# EAGLE design Yukari 3 11DoF (EAGLE 6.2)
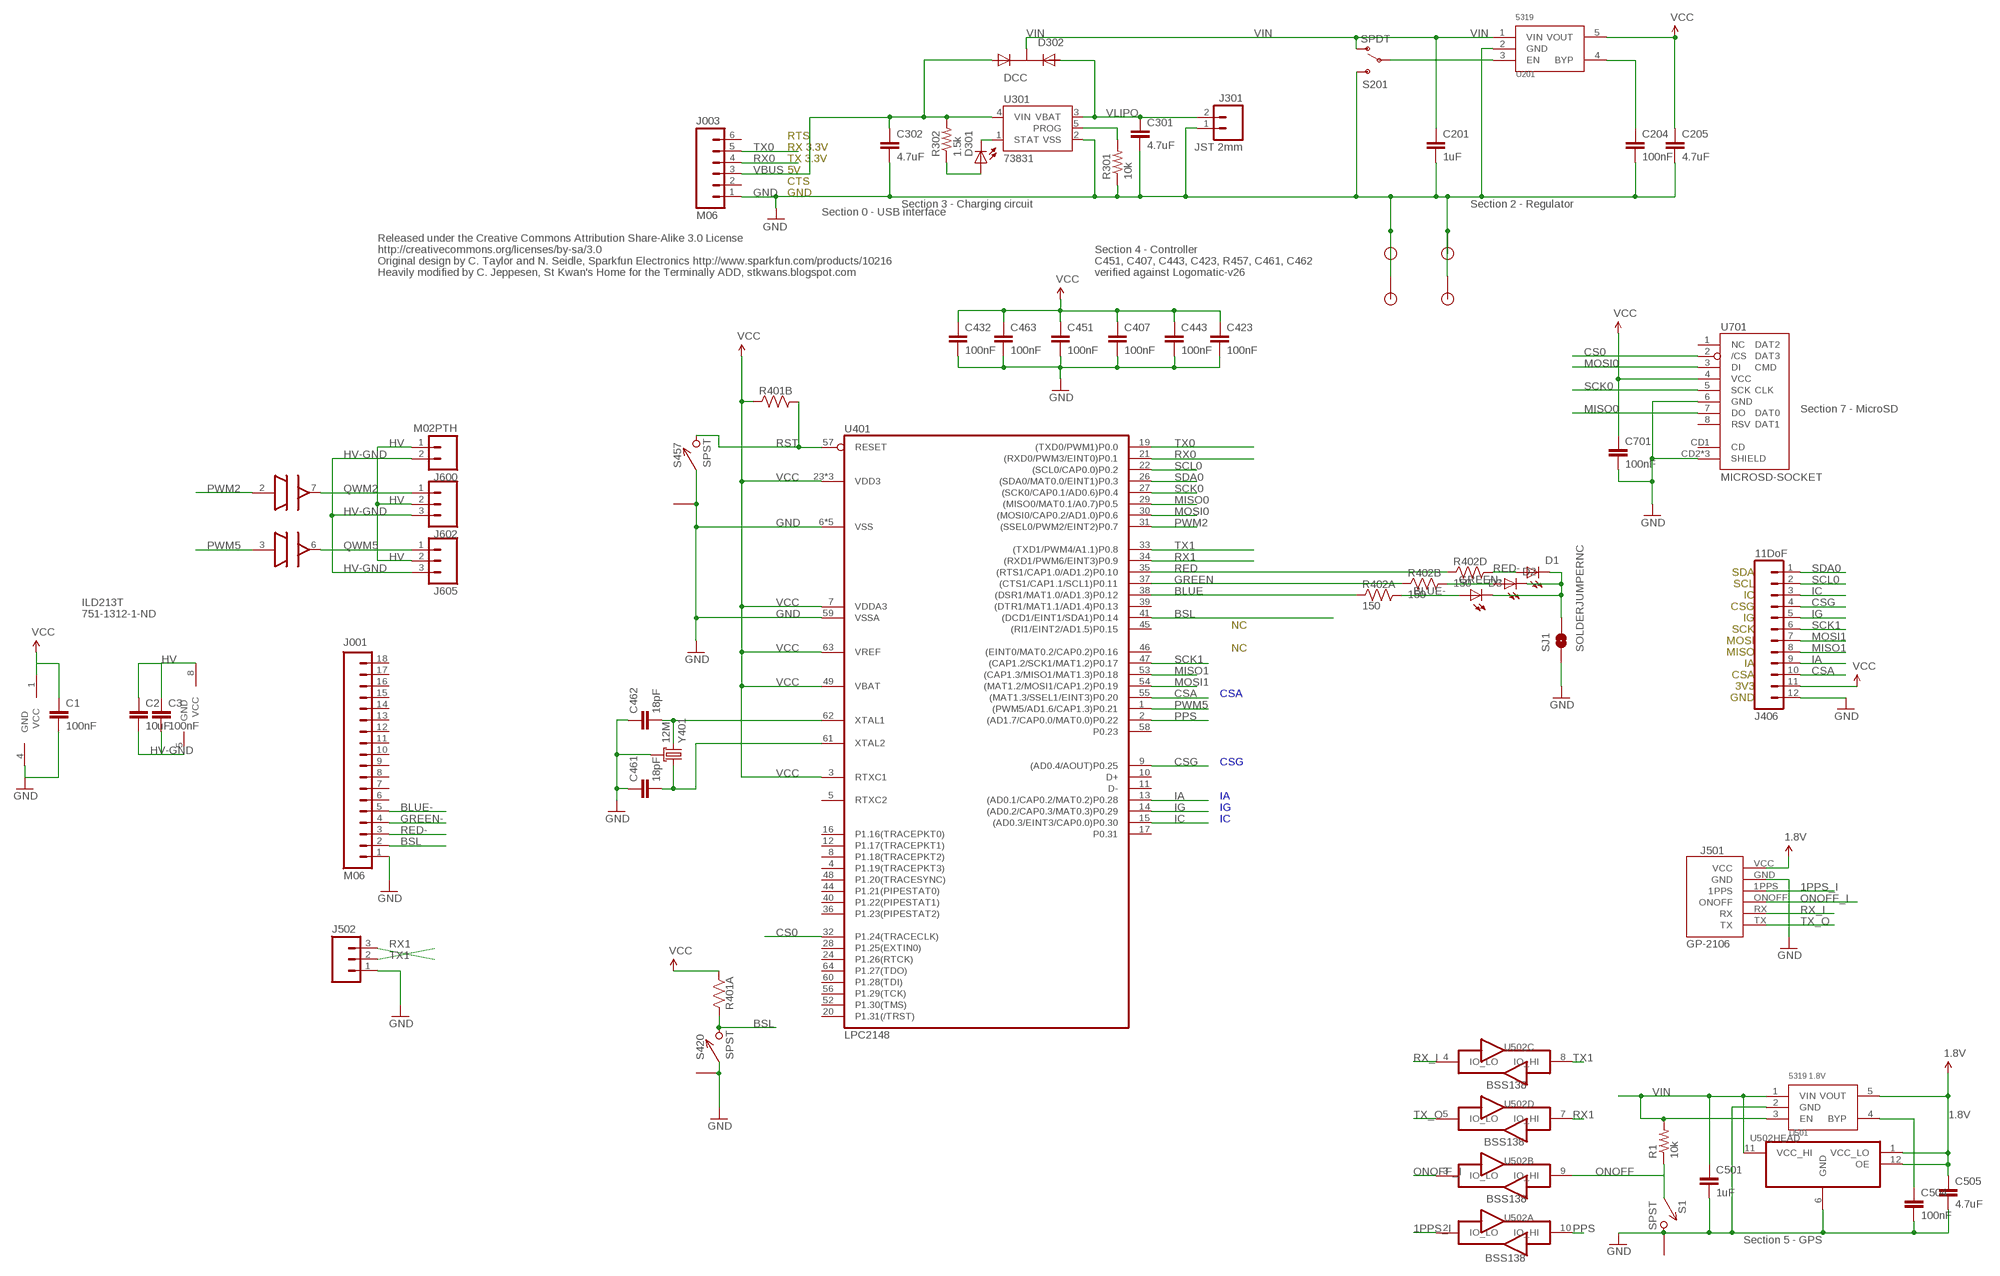
[diagram p0: schematic, sheet 1]

## Parts
C1  100nF  CAP0402-CAP  [0402-CAP]
C2  10uF  10UF-6.3V-20%(1206)  [1206]
C3  100nF  CAP0402-CAP  [0402-CAP]
C201  1uF  CAP0402-CAP  [0402-CAP]
C204  100nF  CAP0402-CAP  [0402-CAP]
C205  4.7uF  CAP0402-CAP  [0402-CAP]
C301  4.7uF  CAP0402-CAP  [0402-CAP]
C302  4.7uF  CAP0402-CAP  [0402-CAP]
C407  100nF  CAP0402-CAP  [0402-CAP]
C423  100nF  CAP0402-CAP  [0402-CAP]
C432  100nF  CAP0402-CAP  [0402-CAP]
C443  100nF  CAP0402-CAP  [0402-CAP]
C451  100nF  CAP0402-CAP  [0402-CAP]
C461  18pF  CAP0402-CAP  [0402-CAP]
C462  18pF  CAP0402-CAP  [0402-CAP]
C463  100nF  CAP0402-CAP  [0402-CAP]
C501  1uF  CAP0402-CAP  [0402-CAP]
C504  100nF  CAP0402-CAP  [0402-CAP]
C505  4.7uF  CAP0402-CAP  [0402-CAP]
C701  100nF  CAP0402-CAP  [0402-CAP]
D1  RED  LED0603  [LED-0603]
D2  GREEN  LED0603  [LED-0603]
D3  BLUE  LED0603  [LED-0603]
D301  RED  LED0603  [LED-0603]
D302  DCC  PMEG2005CT  [SOT-23-3]
J001  M06  M18_  [1X18]
J003  M06  M06SIP  [1X06]
J301  JST 2mm  M02-JST-2MM-SMT  [JST-2-SMD]
J406  11DoF  M12PTH  [1X12]
J501  GP-2106  [GP-2106]
J502  M03PTH  [1X03]
J600  M02PTH  [1X02]
J602  M03PTH  [1X03]
J605  M03PTH  [1X03]
JP1  STANDOFF  [STANDOFF]
JP2  STANDOFF  [STANDOFF]
JP3  STANDOFF  [STANDOFF]
JP4  STANDOFF  [STANDOFF]
R1  10k  RESISTOR0402-RES  [0402-RES]
R301  10k  RESISTOR0402-RES  [0402-RES]
R302  1.5k  RESISTOR0402-RES  [0402-RES]
R401  RP2EXB24V  [CRA02]
R402  150  RP404  [CRA04]
S1  SPST  B3U-1100P  [B3U-1100P]
S201  SPDT  SWITCH-SPSTSMD  [AYZ0202]
S420  SPST  B3U-1100P  [B3U-1100P]
S457  SPST  B3U-1100P  [B3U-1100P]
SJ1  SOLDERJUMPERNC  [SJ_2S]
U201  5319  MIC5319D5  [SOT-23-5]
U301  73831  MCP73831  [SOT23-5]
U401  LPC2148  [LQFP64]
U501  5319 1.8V  MIC5319D5  [SOT-23-5]
U502  TXB0104RUT  [R-PUQFN-N12]
U600  ADUM3221  [SO8N]
U701  MICROSD-SOCKET  [MICROSD-SOCKET-PP]
Y401  12M  TSX-3225  [CRYSTAL_SMD]

## Nets
1.8V: C505.1 J501.VCC U501.5(VOUT) U502.1(HEAD:VCC_LO) U502.12(HEAD:OE)
1PPS_I: J501.1PPS U502.2(A:IO_LO)
BLUE: R402.1 U401.38((DSR1/MAT1.0/AD1.3)P0.12)
BLUE-: D3.A J001.5 R402.8
BSL: J001.2 R401.4 S420.P$2 U401.41((DCD1/EINT1/SDA1)P0.14)
CHG_PROG: R301.2 U301.5(PROG)
CS0: U401.32(P1.24(TRACECLK)) U701.2(/CS)
CSA: J406.10 U401.55((MAT1.3/SSEL1/EINT3)P0.20)
CSG: J406.4 U401.9((AD0.4/AOUT)P0.25)
EN: S201.2(P) U201.3(EN)
GND: C1.2 C201.2 C204.2 C205.2 C301.2 C302.2 C407.2 C423.2 C432.2 C443.2 C451.2 C461.1 C462.1 C463.2 C501.2 C504.2 C505.2 C701.2 J001.1 J003.1 J301.1 J406.12 J501.GND J502.1 JP1.P$1 JP2.P$1 JP3.P$1 JP4.P$1 R301.1 S1.P$2 S1.P$3 S201.3(S) S420.P$1 S420.P$3 S457.P$1 S457.P$3 SJ1.1 U201.2(GND) U301.2(VSS) U401.6(VSS) U401.18(VSS) U401.25(VSS) U401.42(VSS) U401.50(VSS) U401.59(VSSA) U501.2(GND) U502.6(HEAD:GND) U600.4(INP:GND) U701.6(GND) U701.CD2(SHIELD) U701.GND1(SHIELD) U701.GND3(SHIELD) Y401.2(GND) Y401.4(GND)
GREEN: R402.2 U401.37((CTS1/CAP1.1/SCL1)P0.11)
GREEN-: D2.A J001.4 R402.7
HV: C2.1 C3.1 J600.1 J602.2 J605.2 U600.8(OUTP:VCC)
HV-GND: C2.2 C3.2 J600.2 J602.3 J605.3 U600.5(OUTP:GND)
IA: J406.9 U401.13((AD0.1/CAP0.2/MAT0.2)P0.28)
IC: J406.3 U401.15((AD0.3/EINT3/CAP0.0)P0.30)
IG: J406.5 U401.14((AD0.2/CAP0.3/MAT0.3)P0.29)
MISO0: U401.29((MISO0/MAT0.1/A0.7)P0.5) U701.7(DO)
MISO1: J406.8 U401.53((CAP1.3/MISO1/MAT1.3)P0.18)
MOSI0: U401.30((MOSI0/CAP0.2/AD1.0)P0.6) U701.3(DI)
MOSI1: J406.7 U401.54((MAT1.2/MOSI1/CAP1.2)P0.19)
N$1: D1.C D2.C D3.C SJ1.2
N$12: C504.1 U501.4(BYP)
N$17: C204.1 U201.4(BYP)
ONOFF: R1.1 S1.P$1 U502.9(B:IO_HI)
ONOFF_I: J501.ONOFF U502.3(B:IO_LO)
PPS: U401.2((AD1.7/CAP0.0/MAT0.0)P0.22) U502.10(A:IO_HI)
PWM2: U401.31((SSEL0/PWM2/EINT2)P0.7) U600.2(A:IN)
PWM5: U401.1((PWM5/AD1.6/CAP1.3)P0.21) U600.3(B:IN)
QWM2: J602.1 U600.7(A:OUT)
QWM5: J605.1 U600.6(B:OUT)
RED: R402.4 U401.35((RTS1/CAP1.0/AD1.2)P0.10)
RED-: D1.A J001.3 R402.5
RST: R401.3 S457.P$2 U401.57(RESET)
RX0: J003.4 U401.21((RXD0/PWM3/EINT0)P0.1)
RX1: J502.2 U401.34((RXD1/PWM6/EINT3)P0.9) U502.7(D:IO_HI)
RX_I: J501.RX U502.4(C:IO_LO)
SCK0: U401.27((SCK0/CAP0.1/AD0.6)P0.4) U701.5(SCK)
SCK1: J406.6 U401.47((CAP1.2/SCK1/MAT1.2)P0.17)
SCL0: J406.2 U401.22((SCL0/CAP0.0)P0.2)
SDA0: J406.1 U401.26((SDA0/MAT0.0/EINT1)P0.3)
STAT+: D301.A R302.1
STAT-: D301.C U301.1(STAT)
TX0: J003.5 U401.19((TXD0/PWM1)P0.0)
TX1: J502.3 U401.33((TXD1/PWM4/A1.1)P0.8) U502.8(C:IO_HI)
TX_O: J501.TX U502.5(D:IO_LO)
VBUS [power]: C302.1 D302.1(A1) J003.3 R302.2 U301.4(VIN)
VCC: C1.1 C205.1 C407.1 C423.1 C432.1 C443.1 C451.1 C463.1 C701.1 J406.11 R401.1 R401.2 U201.5(VOUT) U401.3(RTXC1) U401.7(VDDA3) U401.23(VDD3) U401.43(VDD3) U401.49(VBAT) U401.51(VDD3) U401.63(VREF) U600.1(INP:VCC) U701.4(VCC)
VIN: C201.1 C501.1 D302.3(K) R1.2 S201.1(O) U201.1(VIN) U501.1(VIN) U501.3(EN) U502.11(HEAD:VCC_HI)
VLIPO [power]: C301.1 D302.2(A2) J301.2 U301.3(VBAT)
XTAL1: C462.2 U401.62(XTAL1) Y401.3
XTAL2: C461.2 U401.61(XTAL2) Y401.1
Unconnected: J001.6 J001.7 J001.8 J001.9 J001.10 J001.11 J001.12 J001.13 J001.14 J001.15 J001.16 J001.17 J001.18 J003.2 J003.6 R402.3 R402.6 U401.4(P1.19(TRACEPKT3)) U401.5(RTXC2) U401.8(P1.18(TRACEPKT2)) U401.10(D+) U401.11(D-) U401.12(P1.17(TRACEPKT1)) U401.16(P1.16(TRACEPKT0)) U401.17(P0.31) U401.20(P1.31(/TRST)) U401.24(P1.26(RTCK)) U401.28(P1.25(EXTIN0)) U401.36(P1.23(PIPESTAT2)) U401.39((DTR1/MAT1.1/AD1.4)P0.13) U401.40(P1.22(PIPESTAT1)) U401.44(P1.21(PIPESTAT0)) U401.45((RI1/EINT2/AD1.5)P0.15) U401.46((EINT0/MAT0.2/CAP0.2)P0.16) U401.48(P1.20(TRACESYNC)) U401.52(P1.30(TMS)) U401.56(P1.29(TCK)) U401.58(P0.23) U401.60(P1.28(TDI)) U401.64(P1.27(TDO)) U701.1(NC) U701.8(RSV) U701.CD1(CD)

## Notes on the sheet
- RTS
- RX 3.3V
- TX 3.3V
- 5V
- CTS
- GND
- Section 0 - USB interface | Section 3 - Charging circuit | Section 2 - Regulator
- Released under the Creative Commons Attribution Share-Alike 3.0 License
- http://creativecommons.org/licenses/by-sa/3.0 | Section 4 - Controller
- Original design by C. Taylor and N. Seidle, Sparkfun Electronics http://www.sparkfun.com/products/10216 | C451, C407, C443, C423, R457, C461, C462
- Heavily modified by C. Jeppesen, St Kwan's Home for the Terminally ADD, stkwans.blogspot.com | verified against Logomatic-v26
- Section 7 - MicroSD
- SDA
- SCL
- IC
- ILD213T | CSG
- 751-1312-1-ND | IG
- NC | SCK
- MOSI
- NC | MISO
- IA
- CSA
- 3V3
- CSA | GND
- CSG
- IA
- IG
- IC
- BSS138
- BSS138
- BSS138
- Section 5 - GPS
- BSS138

## Library data of the parts
C1 C3 C201 C204 C205 C301 C302 C407 C423 C432 C443 C451 C461-C463 C701 = SparkFun:CAP: Capacitor Standard 0603 ceramic capacitor, and 0.1" leaded capacitor.
C2 = SparkFun-Capacitors:10UF-6.3V-20%(1206): Ceramic CAP-10057; PROD_ID: CAP-10057
C501 = SparkFun:CAP: Capacitor Standard 0603 ceramic capacitor, and 0.1" leaded capacitor.; DIGIKEY: 445-4114-1-ND
C504 = SparkFun:CAP: Capacitor Standard 0603 ceramic capacitor, and 0.1" leaded capacitor.; DIGIKEY: 445-1265-1-ND
C505 = SparkFun:CAP: Capacitor Standard 0603 ceramic capacitor, and 0.1" leaded capacitor.; DIGIKEY: 445-7395-1-ND
D1-D3 D301 = SparkFun:LED: LEDs Standard schematic elements and footprints for 5mm, 3mm, 1206, and 0603 sized LEDs. 5mm - Spark Fun Electronics SKU : COM-00529 (and others)
D302 = KwanSystems:PMEG2005CT
J001 = SparkFun-Connectors:M18: 1x18 .1" header
J003 = SparkFun:M06: Header 6 Standard 6-pin 0.1" header. Use with straight break away headers (SKU : PRT-00116), right angle break away headers (PRT-00553), swiss pins (PRT-00743), machine pins (PRT-00117), and female headers (PRT-00115). Molex polarized connector foot print use with SKU : PRT-08094 with associated crimp pins and housings. NOTES ON THE VARIANTS LOCK and LOCK_LONGPADS... This footprint was designed to help hold the alignment of a through-hole component (i.e. 6-pin header) while soldering it into place. You may notice that each hole has been shifted either up or down by 0.005 of an inch from it's more standard position (which is a perfectly straight line). This slight alteration caused the pins (the squares in the middle) to touch the edges of the holes. Because they are alternating, it causes a "brace" to hold the component in place. 0.005 has proven to be the perfect amount of "off-center" position when using our standard breakaway headers. Although looks a little odd when you look at the bare footprint, once you have a header in there, the alteration is very hard to notice. Also, if you push a header all the way into place, it is covered up entirely on the bottom side. This idea of altering the position of holes to aid alignment will be further integrated into the Sparkfun Library for other footprints. It can help hold any component with 3 or more connection pins.
J301 = SparkFun:M02: Header 2 Standard 2-pin 0.1" header. Use with straight break away headers (SKU : PRT-00116), right angle break away headers (PRT-00553), swiss pins (PRT-00743), machine pins (PRT-00117), and female headers (PRT-00115). Molex polarized connector foot print use with SKU : PRT-08233 with associated crimp pins and housings.
J406 = SparkFun:M12: Header 12 Standard 12-pin 0.1" header. Use with straight break away headers (SKU : PRT-00116), right angle break away headers (PRT-00553), swiss pins (PRT-00743), machine pins (PRT-00117), and female headers (PRT-00115).
J501 = SparkFun:GP-2106: GP-2106 GPS SiRF IV
J502 J602 J605 = SparkFun-Connectors:M03: Header 3 Standard 3-pin 0.1" header. Use with straight break away headers (SKU : PRT-00116), right angle break away headers (PRT-00553), swiss pins (PRT-00743), machine pins (PRT-00117), and female headers (PRT-00115). Molex polarized connector foot print use with SKU : PRT-08232 with associated crimp pins and housings.
J600 = SparkFun-Connectors:M02: Standard 2-pin 0.1" header. Use with - straight break away headers ( PRT-00116) - right angle break away headers (PRT-00553) - swiss pins (PRT-00743) - machine pins (PRT-00117) - female headers (PRT-00115) Molex polarized connector foot print use with: PRT-08233 with associated crimp pins and housings. 2.54_SCREWTERM for use with PRT-10571. 3.5mm Screw Terminal footprints for PRT-08084 5mm Screw Terminal footprints for use with PRT-08433
JP1-JP4 = KwanSystems:STANDOFF
R1 R301 R302 = SparkFun:RESISTOR: Resistor Basic schematic elements and footprints for 0603, 1206, and PTH resistors.
R401 = KwanSystems:RP2
R402 = KwanSystems:RP4
S1 S420 S457 = KwanSystems:B3U-1100P
S201 = SparkFun:SWITCH-SPST: SPST Switch Simple slide switch. Spark Fun Electronics SKU : COM-00102
SJ1 = SparkFun-Passives:SOLDERJUMPER: Solder Jumper Standard SMD solder jumper. Used to automate production. Two varients : Normally Open and Normally Closed are the same, but have different paste layers. NC will have a large amount of paste and should jumper during reflow.
U201 = KwanSystems:MIC5319
U301 = SparkFun:MCP73831: Microchip's MCP73831 Miniature single cell, fully integrated Li-Ion, Li-polymer charge management controller http://ww1.microchip.com/downloads/en/DeviceDoc/21984a.pdf
U401 = KwanSystems:LPC2148
U501 = KwanSystems:MIC5319; DIGIKEY: 576-1910-1-ND
U502 = KwanSystems:TXB0104
U600 = KwanSystems:ADUM3221
U701 = KwanSystems:MICROSD-SOCKET: microSD Socket Push-push type uSD socket. Digikey 101-00660-68-6-1-ND. tDoc lines correctly indicate media card edge positions when inserting (unlocked, locked, depressed).
Y401 = KwanSystems:TSX-3225

## Net classes
0 default: width 0.152 mm, drill 0.33 mm, clearance 0.152 mm
1 power: width 0.152 mm, drill 0.33 mm, clearance 0.152 mm
2 hp: width 0.508 mm, drill 0.33 mm, clearance 0.508 mm

## Board
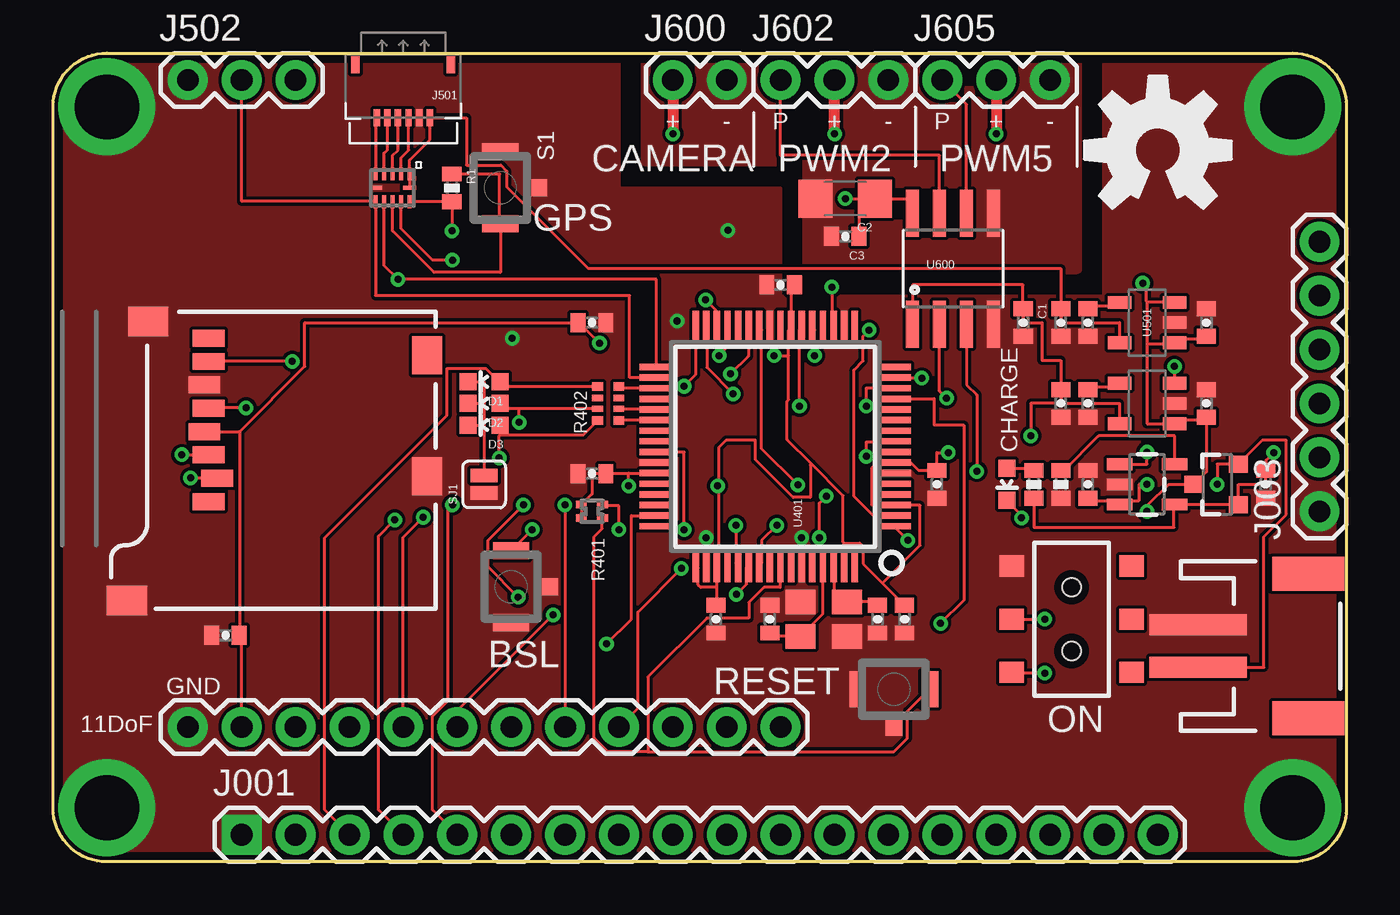
[diagram p1: board, top side]
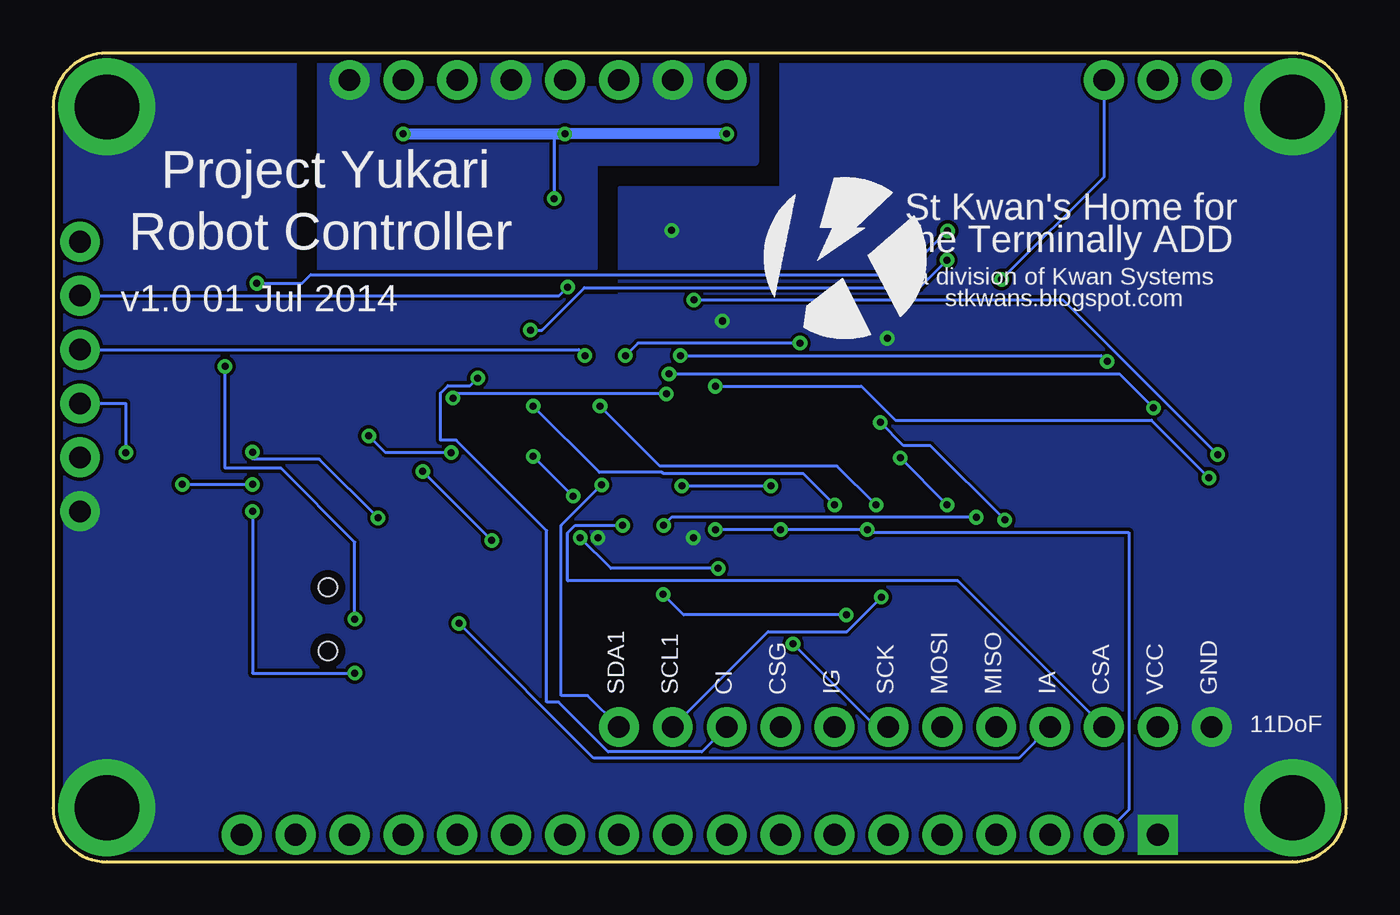
[diagram p2: board, bottom side, seen from below]

Size 60.96 x 38.1 mm. Coordinates in mm from the lower left corner, seen from the top.
Outline: 2.54,38.1 58.42,38.1 arc-90 60.96,35.56 60.96,2.54 arc-90 58.42,0 2.54,0 arc-90 0,2.54 0,35.56 arc-90 2.54,38.1
Copper layers (1*16): Top 0.0356mm / dielectric 1.5011mm / Bottom 0.0356mm
Design rules: minimum track width 6mil, minimum drill 13mil, track to track 6mil, track to pad 6mil, pad to pad 6mil, via to via 6mil, smd to smd 6mil, copper to edge 15mil, drill to drill 6mil, minimum pad ring 7mil, minimum via ring 7mil, stop-mask expansion 4mil, vias tented up to drill 14mil, thermal gap 10mil
vRestrict: area 4.8,2.8 to 7.6,3.6; area 7.1,3.8 to 10.4,4.6; area 9.4,2.8 to 13,3.6; area 13.2,2.8 to 14.5,4.8; area 15.7,2.8 to 17,4.8; area 18.3,2.8 to 19.6,4.8; area 20.8,2.8 to 22.1,4.8; area 23.4,2.8 to 24.6,4.8; area 25.9,2.8 to 27.2,4.8; area 28.4,2.8 to 29.7,4.8; area 31,2.8 to 32.3,4.8; area 33.5,2.8 to 34.8,4.8; 44 more areas

### Footprints (pad centres in the part's own frame; a part is rotated, then mirrored left to right if it is on the bottom)
0402-CAP = smd 0.7 x 0.9: 1 -0.65,0; 2 0.65,0
1206 = smd 1.6 x 1.8: 1 -1.4,0; 2 1.4,0
LED-0603 = smd 0.8 x 0.8: A 0,-0.75; C 0,0.75
SOT-23-3 = smd 0.9 x 0.8: 1 -1,0.95; 2 -1,-0.95; 3 1.1,0
1X18 = drill 1.016 pad 1.88 square: 1 0,0 | drill 1.016 pad 1.88: 2 2.54,0; 3 5.08,0; 4 7.62,0; 5 10.16,0; 6 12.7,0; 7 15.24,0; 8 17.78,0; 9 20.32,0; 10 22.86,0; 11 25.4,0; 12 27.94,0; 13 30.48,0; 14 33.02,0; 15 35.56,0; 16 38.1,0; 17 40.64,0; 18 43.18,0
1X06 = drill 1.016 pad 1.88: 1 0,0; 2 2.54,0; 3 5.08,0; 4 7.62,0; 5 10.16,0; 6 12.7,0
JST-2-SMD = smd 1 x 4.6: 1 -1,-3.7; 2 1,-3.7 | smd 1.6 x 3.4: NC1 -3.4,1.5; NC2 3.4,1.5
1X12 = drill 1.016 pad 1.88: 1 0,0; 2 2.54,0; 3 5.08,0; 4 7.62,0; 5 10.16,0; 6 12.7,0; 7 15.24,0; 8 17.78,0; 9 20.32,0; 10 22.86,0; 11 25.4,0; 12 27.94,0
GP-2106 = smd 0.3 x 0.8: 1PPS -0.25,0; GND -0.75,0; ONOFF 0.25,0; RX 0.75,0; TX 1.25,0; VCC -1.25,0 | smd 0.4 x 0.8: P$7 -2.25,-2.5; P$8 2.25,-2.5
1X03 = drill 1.016 pad 1.88: 1 0,0; 2 2.54,0; 3 5.08,0
1X02 = drill 1.016 pad 1.88: 1 0,0; 2 2.54,0
STANDOFF = drill 3.048 pad 4.572: P$1 0,0
0402-RES = smd 0.7 x 0.9: 1 -0.65,0; 2 0.65,0
CRA02 = smd 0.35 x 0.5: 1 -0.325,-0.5; 2 0.325,-0.5; 3 0.325,0.5; 4 -0.325,0.5
CRA04 = smd 0.4 x 0.5: 1 -0.8,-0.5; 4 0.8,-0.5; 5 0.8,0.5; 8 -0.8,0.5 | smd 0.3 x 0.5: 2 -0.25,-0.5; 3 0.25,-0.5; 6 0.25,0.5; 7 -0.25,0.5
B3U-1100P = smd 0.8 x 1.7: P$1 -1.7,0; P$2 1.7,0 | smd 0.8 x 1.1: P$3 0,-1.65
AYZ0202 = smd 1 x 1.15: 1 -2.5,2.825; 2 0,2.825; 3 2.5,2.825; 4 -2.5,-2.825; 5 0,-2.825; 6 2.5,-2.825 | hole 0.85: 1.5,0; -1.5,0
SJ_2S = smd 0.635 x 1.27: 1 -0.412,0; 2 0.412,0
SOT-23-5 = smd 0.6 x 1.1: 1 -0.95,-1.3; 2 0,-1.3; 3 0.95,-1.3; 4 0.95,1.3; 5 -0.95,1.3
SOT23-5 = smd 0.55 x 1.2: 1 -0.95,-1.3; 2 0,-1.3; 3 0.95,-1.3; 4 0.95,1.3; 5 -0.95,1.3
LQFP64 = smd 0.3 x 1.6: 1 -3.75,-5.6; 2 -3.25,-5.6; 3 -2.75,-5.6; 4 -2.25,-5.6; 5 -1.75,-5.6; 6 -1.25,-5.6; 7 -0.75,-5.6; 8 -0.25,-5.6; 9 0.25,-5.6; 10 0.75,-5.6; 11 1.25,-5.6; 12 1.75,-5.6; 13 2.25,-5.6; 14 2.75,-5.6; 15 3.25,-5.6; 16 3.75,-5.6; 33 3.75,5.6; 34 3.25,5.6; 35 2.75,5.6; 36 2.25,5.6; 37 1.75,5.6; 38 1.25,5.6; 39 0.75,5.6; 40 0.25,5.6; 41 -0.25,5.6; 42 -0.75,5.6; 43 -1.25,5.6; 44 -1.75,5.6; 45 -2.25,5.6; 46 -2.75,5.6; 47 -3.25,5.6; 48 -3.75,5.6 | smd 1.6 x 0.3: 17 5.6,-3.75; 18 5.6,-3.25; 19 5.6,-2.75; 20 5.6,-2.25; 21 5.6,-1.75; 22 5.6,-1.25; 23 5.6,-0.75; 24 5.6,-0.25; 25 5.6,0.25; 26 5.6,0.75; 27 5.6,1.25; 28 5.6,1.75; 29 5.6,2.25; 30 5.6,2.75; 31 5.6,3.25; 32 5.6,3.75; 49 -5.6,3.75; 50 -5.6,3.25; 51 -5.6,2.75; 52 -5.6,2.25; 53 -5.6,1.75; 54 -5.6,1.25; 55 -5.6,0.75; 56 -5.6,0.25; 57 -5.6,-0.25; 58 -5.6,-0.75; 59 -5.6,-1.25; 60 -5.6,-1.75; 61 -5.6,-2.25; 62 -5.6,-2.75; 63 -5.6,-3.25; 64 -5.6,-3.75
R-PUQFN-N12 = smd 0.2 x 0.6: 1 -0.8,-0.65; 2 -0.4,-0.65; 3 0,-0.65; 4 0.4,-0.65; 5 0.8,-0.65; 7 0.8,0.65; 8 0.4,0.65; 9 0,0.65; 10 -0.4,0.65; 11 -0.8,0.65 | smd 0.6 x 0.2: 6 0.8,0; 12 -0.8,0
SO8N = smd 0.61 x 2.21: 1 -1.905,-2.616; 2 -0.635,-2.616; 3 0.635,-2.616; 4 1.905,-2.616; 5 1.905,2.616; 6 0.635,2.616; 7 -0.635,2.616; 8 -1.905,2.616
MICROSD-SOCKET-PP = smd 0.8 x 1.5: 1 -8.94,10.7; 2 -7.84,10.3; 3 -6.74,10.7; 4 -5.64,10.9; 5 -4.54,10.7; 6 -3.44,10.9; 7 -2.34,10.7; 8 -1.24,10.7 | smd 1.8 x 1.4: CD1 -2.05,0.4; CD2 -7.75,0.4 | smd 1.4 x 1.9: GND1 -13.6,14.55; GND3 -0.45,13.55
CRYSTAL_SMD = smd 1.4 x 1.15: 1 -1.092,-0.813; 2 1.092,-0.813; 3 1.092,0.813; 4 -1.092,0.813

### Placement (x,y rotation side)
C1  45.72,25.4 270 top
C2  37.34,31.24 180 top
C3  37.34,29.46 180 top
C201  54.36,21.59 90 top
C204  48.77,21.59 270 top
C205  47.5,21.59 270 top
C301  48.77,17.78 90 top
C302  57.15,17.78 270 top
C407  41.66,17.78 270 top
C423  34.29,27.18 180 top
C432  25.4,25.4 0 top
C443  25.4,18.29 180 top
C451  31.24,11.43 270 top
C461  33.78,11.43 270 top
C462  38.86,11.43 90 top
C463  40.13,11.43 270 top
C501  54.36,25.4 90 top
C504  48.77,25.4 270 top
C505  47.5,25.4 270 top
C701  8.13,10.67 180 top
D1  20.32,22.61 90 top
D2  20.32,21.59 90 top
D3  20.32,20.57 90 top
D301  44.96,17.78 180 top
D302  54.86,17.78 180 top
J001  8.89,1.27 0 top
J003  59.69,16.51 90 top
J301  57.66,10.16 270 top
J406  34.29,6.35 180 top
J501  16.51,35.05 180 top
J502  6.35,36.83 0 top
J600  29.21,36.83 0 top
J602  34.29,36.83 0 top
J605  41.91,36.83 0 top
JP1  2.54,2.54 0 top
JP2  58.42,2.54 0 top
JP3  2.54,35.56 0 top
JP4  58.42,35.56 0 top
R1  18.8,31.75 270 top
R301  47.5,17.78 90 top
R302  46.23,17.78 270 top
R401  25.4,16.51 270 top
R402  26.16,21.59 90 top
S1  21.08,31.75 90 top
S201  48.01,11.43 90 top
S420  21.59,12.95 90 top
S457  39.62,8.13 0 top
SJ1  20.32,17.78 90 top
U201  51.56,21.59 90 top
U301  51.56,17.78 270 top
U401  34.04,19.56 90 top
U501  51.56,25.4 90 top
U502  16,31.75 180 top
U600  42.42,27.94 0 top
U701  18.03,25.91 90 top
U$1  [KWAN_CIRCLE]  23.62,28.45 0 bottom
U$2  [OSHW-LOGO-L]  52.07,33.53 0 top
Y401  36.32,11.43 0 top

### Tracks (layer width: path | path; a pad name or v marks a point on that pad's centre or on a via)
1.8V
  Top 0.152: U502.12 U502.1 16.8,33.06 17.76,34.02 J501.VCC 19.48,35.05 19.48,32.82 21.11,32.82 21.39,32.54 21.39,31.8 25.25,27.94 47.5,27.94 C505.1 47.5,25.4 50.26,25.4 U501.5
1PPS_I
  Top 0.152: U502.2 16.4,33.17 16.76,33.52 J501.1PPS
BLUE
  Top 0.152: U401.38 26.68,20.81 arc90 R402.1
BLUE-  (via drill 0.33)
  Top 0.152: 21.08,20.12 24.99,20.12 25.65,20.78 R402.8 | 21.08,20.12 21.08,20.57 D3.A | v21.03,19.02 21.03,20.07 21.08,20.12 | v18.82,16.82 18.62,16.61 18.62,7.59 17.88,6.86 17.88,2.44 J001.5
  Bottom 0.152: v18.82,16.82 v21.03,19.02
BSL  (via drill 0.33)
  Top 0.152: v26.67,15.65 26.67,16.76 25.98,16.76 25.91,16.84 R401.4 | v22.58,15.65 S420.P$2 | v29.74,15.65 29.74,19.3 U401.41
  Bottom 0.152: v29.74,15.65 v26.67,15.65 v22.58,15.65 22.45,15.52 10.26,15.52 10.26,2.44 J001.2
CHG_PROG
  Top 0.152: 52.86,18.75 U301.5 52.86,20.07 49.28,20.07 47.64,18.43 R301.2
CS0  (via drill 0.33)
  Top 0.152: v6.48,18.09 7.72,18.09 U701.2 | v29.74,22.4 30.28,22.94 30.28,25.15 U401.32
  Bottom 0.152: v6.48,18.09 9.2,20.8 21.26,20.8 22.86,22.4 v29.74,22.4
CSA  (via drill 0.33)
  Top 0.152: v34.11,15.85 33.4,15.14 33.4,14.07 U401.55
  Bottom 0.152: v34.11,15.85 36.35,15.85 36.7,15.49 36.7,13.23 18.31,13.23 J406.10
CSG  (via drill 0.33)
  Top 0.152: v38.33,19.1 38.33,19.79 39.62,19.79 U401.9 | v36.45,17.22 36.12,16.89 v36.12,15.27 | v29.62,13.82 27.56,11.76 27.56,7.24 J406.4
  Bottom 0.152: v36.45,17.22 v38.33,19.1 | v36.12,15.27 34.67,13.82 v29.62,13.82
EN  (via drill 0.33)
  Top 0.152: v52.86,23.34 52.86,22.55 U201.3 | 45.44,11.43 S201.2 v46.74,11.43
  Bottom 0.152: v52.86,23.34 52.86,18.54 50.22,18.54 46.74,15.06 v46.74,11.43
GND  (via drill 0.33)
  other vias: 30.78,15.27 35.28,15.27 29.41,25.48 21.64,24.66 31.8,29.74
  pour Top (no thermals): 2.54,38.1 26.67,38.1 26.67,31.75 34.29,31.75 34.29,26.67 49.53,26.67 49.53,38.1 58.42,38.1 arc-90 60.96,35.56 60.96,2.54 arc-90 58.42,0 2.54,0 arc-90 0,2.54 0,35.56 arc-90
  pour Bottom (no thermals): 26.67,38.1 26.67,31.75 34.29,31.75 34.29,26.67 49.53,26.67 49.53,38.1 58.42,38.1 arc-90 60.96,35.56 60.96,2.54 arc-90 58.42,0 2.54,0 arc-90 0,2.54 0,35.56 arc-90 2.54,38.1
GREEN
  Top 0.152: U401.37 26.69,21.31 arc-90 R402.2
GREEN-  (via drill 0.33)
  Top 0.152: 21.97,21.36 21.08,21.36 21.08,21.59 D2.A | 21.97,21.36 25.65,21.36 R402.7 | v21.97,20.7 21.97,21.36 | v16.1,16.1 15.34,15.34 15.34,2.44 J001.4
  Bottom 0.152: v21.97,20.7 20.88,19.61 19.61,19.61 v16.1,16.1
HV  (via drill 0.33)
  Top 0.152: 44.22,34.16 v44.45,34.29 | C2.1 37.99,30.48 C3.1 | C2.1 40.51,31.24 U600.8 | v37.34,31.24 C2.1
  Top 0.508: J600.1 v29.21,34.29 | v36.83,34.29 J602.2 | J605.2 v44.45,34.29
  Bottom 0.152: v36.83,34.29 37.34,34.29 v37.34,31.24
  Bottom 0.508: v29.21,34.29 v36.83,34.29 v44.45,34.29
HV-GND
  pour Bottom (no thermals): 27.94,38.1 27.94,33.02 35.56,33.02 35.56,27.94 48.26,27.94 48.26,38.1
  pour Top (no thermals): 27.94,38.1 27.94,33.02 35.56,33.02 35.56,27.94 48.26,27.94 48.26,38.1
IA  (via drill 0.33)
  Top 0.152: 41.53,21.81 41.53,20.57 42.93,20.57 42.93,12.32 v41.83,11.23 | U401.13 41.53,21.81 | 41.53,21.81 41.53,21.82
  Bottom 0.152: v41.83,11.23 35.48,4.88 15.44,4.88 J406.9
IC  (via drill 0.33)
  Top 0.152: U401.15 40.95,22.81 v40.95,22.78
  Bottom 0.152: v40.95,22.78 41.3,22.43 42.34,22.43 42.7,22.07 42.7,19.86 41.96,19.86 37.69,15.6 37.69,7.52 37.13,7.52 34.8,5.18 30.38,5.18 J406.3
IG  (via drill 0.33)
  Top 0.152: v38.33,21.46 38.33,22.31 U401.14 | v24.13,16.82 24.16,16.79 24.16,6.38 J406.5
  Bottom 0.152: v38.33,21.46 35.2,18.34 32.26,18.34 32.21,18.29 25.6,18.29 v24.13,16.82
MISO0  (via drill 0.33)
  Top 0.152: v11.28,23.57 U701.7 | v31.39,23.85 31.77,24.23 31.77,25.15 U401.29
  Bottom 0.152: v11.28,23.57 11.56,23.85 v31.39,23.85
MISO1  (via drill 0.33)
  Top 0.152: v32.18,15.85 32.18,14.07 U401.53 | v17.45,16.23 16.51,15.29 J406.8
  Bottom 0.152: v32.18,15.85 31.8,16.23 v17.45,16.23
MOSI0  (via drill 0.33)
  Top 0.152: v6.07,19.18 7.32,19.18 U701.3 | v30.76,26.47 31.27,25.96 31.27,25.17 U401.30
  Bottom 0.152: v6.07,19.18 13.36,26.47 v30.76,26.47
MOSI1  (via drill 0.33)
  Top 0.152: v32.21,12.6 32.69,13.08 32.69,13.87 32.77,13.95 U401.54 | v23.57,11.63 19.05,7.11 J406.7
  Bottom 0.152: v32.21,12.6 31.24,11.63 v23.57,11.63
N$1
  Top 0.152: D1.C 20.32,22.61 20.32,21.59 | 20.32,21.59 20.32,20.57 | 20.32,20.57 SJ1.2 | D2.C 20.32,21.59 | D3.C 20.32,20.57
N$12
  Top 0.152: U501.4 50.07,26.16 48.88,26.16 arc90 C504.1
N$17
  Top 0.152: U201.4 50.23,22.54 arc90 50.04,22.35 48.88,22.35 arc90 C204.1
ONOFF
  Top 0.152: R1.1 21.06,32.4 21.06,30.12 S1.P$1 21.08,27.76 17.96,27.76 16,29.72 U502.9
ONOFF_I
  Top 0.152: U502.3 16,33.27 16.26,33.53 J501.ONOFF
PPS  (via drill 0.33)
  Top 0.152: v38.46,25.04 38.18,24.77 38.18,23.6 37.74,23.16 37.74,17.22 38.63,16.33 39.62,16.33 U401.2 | v18.82,28.35 17.88,28.35 16.4,29.83 U502.10
  Bottom 0.152: v18.82,28.35 20.12,27.05 35.92,27.05 37.92,25.04 v38.46,25.04
PWM2  (via drill 0.33)
  Top 0.152: v32.05,22.05 30.81,23.29 30.81,25.15 U401.31 | v42.11,21.84 41.78,22.17 U600.2
  Bottom 0.152: v42.11,21.84 41.91,22.05 v32.05,22.05
PWM5  (via drill 0.33)
  Top 0.152: v40.28,15.14 39.65,15.77 39.65,15.8 U401.1 | U600.3 43.05,22.48 43.54,22 v43.54,18.39
  Bottom 0.152: v40.28,15.14 v43.54,18.39
QWM2
  Top 0.152: U600.7 41.78,33.27 34.29,33.27 J602.1
QWM5
  Top 0.152: U600.6 43.05,35.69 J605.1
RED
  Top 0.152: U401.35 26.74,22.31 arc-90 R402.4
RED-
  Top 0.152: R402.5 25.65,22.4 21.08,22.4 21.08,22.61 D1.A 21.01,22.63 20.4,23.24 18.57,23.24 18.57,21.03 12.8,15.27 12.8,2.44 J001.3
RST
  Top 0.152: 28.04,5.18 26.16,5.18 25.5,5.84 25.5,15.32 25.88,15.7 25.88,16.17 R401.3 | 28.04,5.18 28.04,8.71 30.81,11.48 32.79,11.48 32.79,12.22 33.5,12.93 34.27,12.93 34.27,13.95 U401.57 | 28.04,5.18 39.62,5.18 40.26,5.82 40.26,7.09 41.3,8.13 S457.P$2
RX0  (via drill 0.33)
  Top 0.152: v35.89,23.85 35.89,25.04 35.79,25.15 U401.21
  Bottom 0.152: v35.89,23.85 36.17,24.13 J003.4
RX1
  Top 0.152: U401.34 27.18,22.81 27.18,26.67 15.2,26.67 U502.7 15.19,31.11 8.89,31.11 J502.2
RX_I
  Top 0.152: U502.4 15.6,33.38 15.76,33.54 J501.RX
SCK0  (via drill 0.33)
  Top 0.152: v9.09,21.39 7.34,21.39 U701.5 | v31.93,22.99 32.77,23.82 32.77,25.15 U401.27
  Bottom 0.152: v9.09,21.39 10.69,22.99 v31.93,22.99
SCK1  (via drill 0.33)
  Top 0.152: v26.09,10.26 27.25,11.43 27.25,16.31 28.42,16.31 U401.47
  Bottom 0.152: v26.09,10.26 22.17,6.35 J406.6
SCL0  (via drill 0.33)
  Top 0.152: v35.18,21.46 35.18,25.04 35.28,25.15 U401.22 | v22.17,16.82 20.5,15.14 20.5,13.89 v21.92,12.47
  Bottom 0.152: v35.18,21.46 32.36,18.64 24,18.64 v22.17,16.82 | v21.92,12.47 23.55,10.85 27.25,10.85 J406.2
SDA0  (via drill 0.33)
  Top 0.152: v35.1,17.75 33.4,19.46 33.4,25.04 33.3,25.15 U401.26
  Bottom 0.152: v35.1,17.75 37.01,15.85 37.01,7.82 35.76,7.82 J406.1
STAT+
  Top 0.152: D301.A 46.13,18.53 arc-90 R302.1
STAT-  (via drill 0.33)
  Top 0.152: v45.64,16.2 45.64,16.33 44.96,17.02 D301.C | 50.24,18.75 U301.1 51.56,18.73 v51.56,19.3
  Bottom 0.152: v45.64,16.2 48.41,18.97 51.56,18.97 v51.56,19.3
TX0  (via drill 0.33)
  Top 0.152: v36.7,27.08 36.7,25.25 U401.19
  Bottom 0.152: v36.7,27.08 37.11,26.67 J003.5
TX1  (via drill 0.33)
  Top 0.152: U401.33 28.44,27.43 v16.26,27.43 15.6,28.09 U502.8
  Bottom 0.152: J502.3 11.43,32.26 v16.26,27.43
TX_O
  Top 0.152: J501.TX J501.TX arc90 15.2,34.99 U502.5
VBUS  (via drill 0.33)
  Top 0.152: R302.2 46.23,15.75 52.83,15.75 52.83,16.83 U301.4 D302.1 55.86,17.78 57.15,17.78 C302.1 57.17,18.49 57.17,18.92 v57.53,19.28
  Bottom 0.152: J003.3 57.53,21.59 v57.53,19.28
VCC  (via drill 0.33)
  Top 0.152: 47.5,21.59 C205.1 47.5,23.62 46.61,23.62 46.61,25.4 45.72,25.4 C1.1 45.72,27.18 40.51,27.18 U600.1 | 47.5,21.59 50.26,21.59 U201.5 50.19,20.62 | C407.1 40.79,18.44 40.44,18.8 39.65,18.8 U401.7 39.57,18.77 38.81,18.77 38.58,18.54 38.58,16.82 39.62,16.82 U401.3 39.7,16.79 40.87,16.79 40.87,14.91 39.09,13.13 | C407.1 | 26.04,18.29 C443.1 | 27.13,18.31 26.11,18.31 C443.1 | 27.13,18.31 28.42,18.31 U401.43 | 31.27,12.93 31.27,13.95 U401.51 31.32,14.02 31.37,14.07 31.37,17.7 | 31.27,12.93 31.27,12.12 C451.1 | 31.27,12.93 30.53,12.93 30.4,13.06 30.4,13.84 30.3,13.95 U401.49 | C423.1 34.92,27.33 34.8,27.2 U401.23 34.75,25.09 34.67,25.02 34.67,23.85 | 39.09,13.13 38.18,14.05 38.18,14.86 38.02,15.01 37.29,15.01 | 39.09,13.13 C463.1 | 37.29,15.01 U401.63 | 34.67,23.85 34.67,21.77 34.59,21.69 34.59,19.89 35.74,18.75 | 35.74,18.75 37.24,17.25 37.24,15.06 37.29,15.01 | 31.37,17.7 31.37,19.51 31.73,19.86 33.1,19.86 33.1,18.95 34.87,17.17 35.69,17.17 35.69,18.69 35.74,18.75 | v27.13,17.7 27.13,18.31 | v31.32,17.7 31.37,17.7 | J406.11 8.89,10.57 C701.1 8.79,10.72 8.79,20.27 | 8.79,20.27 11.86,23.34 11.86,25.4 C432.1 24.82,25.38 v25.76,24.43 | 8.79,20.27 U701.4 | v33.98,23.85 34.67,23.85 | 47.5,21.59 46.08,21.59 v46.08,20.07 | C407.1 41.66,19.28 v42.19,19.28 | C443.1 25.4,18.29 25.4,17.31 25.38,17.31 R401.1 R401.2
  Bottom 0.152: v46.08,20.07 45.29,19.28 v42.19,19.28 | v31.32,17.7 v27.13,17.7 | v33.98,23.85 33.4,24.43 v25.76,24.43
VIN  (via drill 0.33)
  Top 0.152: C501.1 arc-90 54.24,24.64 53.05,24.64 U501.1 52.86,24.38 51.56,24.38 | U501.3 51.56,26.35 | 51.56,26.35 51.56,24.38 | 51.56,24.38 51.56,20.64 U201.1 53.05,20.83 54.24,20.83 arc90 C201.1 54.36,18.37 D302.3 | U502.11 16.82,31.11 18.8,31.11 R1.2 v18.8,29.72 | 53.77,17.78 D302.3 | 45.44,8.94 S201.1 45.44,8.89 v46.74,8.89 | 53.7,17.75 D302.3 | v51.36,27.25 51.54,27.08 51.54,26.42 51.56,26.35 | D302.3 52.58,17.78 51.56,16.76 v51.56,16.51
  Bottom 0.152: v51.36,27.25 49.23,27.25 48.82,27.66 20.85,27.66 v18.8,29.72 | v51.56,16.51 51.56,8.89 v46.74,8.89
VLIPO  (via drill 0.33)
  Top 0.152: C301.1 48.88,17.02 50.07,17.02 arc-90 U301.3 50.32,16.92 50.29,16.92 50.29,17.02 51.18,17.02 51.18,17.78 v51.56,17.78 | J301.2 57.07,9.16 57.07,15.32 58.12,16.36 58.12,19.86 57,19.86 55.88,18.75 D302.2 54.86,18.73 v54.86,17.78
  Bottom 0.152: v54.86,17.78 v51.56,17.78
XTAL1
  Top 0.152: C462.2 38.86,12.24 Y401.3 36.8,12.24 36.8,13.95 U401.62
XTAL2
  Top 0.152: C461.2 C461.2 arc90 33.95,10.62 Y401.1 36.29,11.67 U401.61 36.27,13.95

### Text on the board
tPlace: + | - | P | + | - | P | + | - | CAMERA | PWM2 | PWM5 | GPS | CHARGE | BSL | RESET | GND | ON | 11DoF
bPlace: Project Yukari | St Kwan's Home for | the Terminally ADD | Robot Controller | a division of Kwan Systems | stkwans.blogspot.com | v1.0 01 Jul 2014 | GND | VCC | CSA | IA | MISO | MOSI | SCK | IG | CSG | CI | SCL1 | SDA1 | 11DoF
Document: Released under the Creative Commons Attribution Share-Alike 3.0 License | http://creativecommons.org/licenses/by-sa/3.0 | Original design by C. Taylor and N. Seidle, Sparkfun Electronics http://www.sparkfun.com/products/10216 | Heavily modified by C. Jeppesen, St Kwan's Home for the Terminally ADD, stkwans.blogspot.com